# Altium project DAQ.PrjPcb
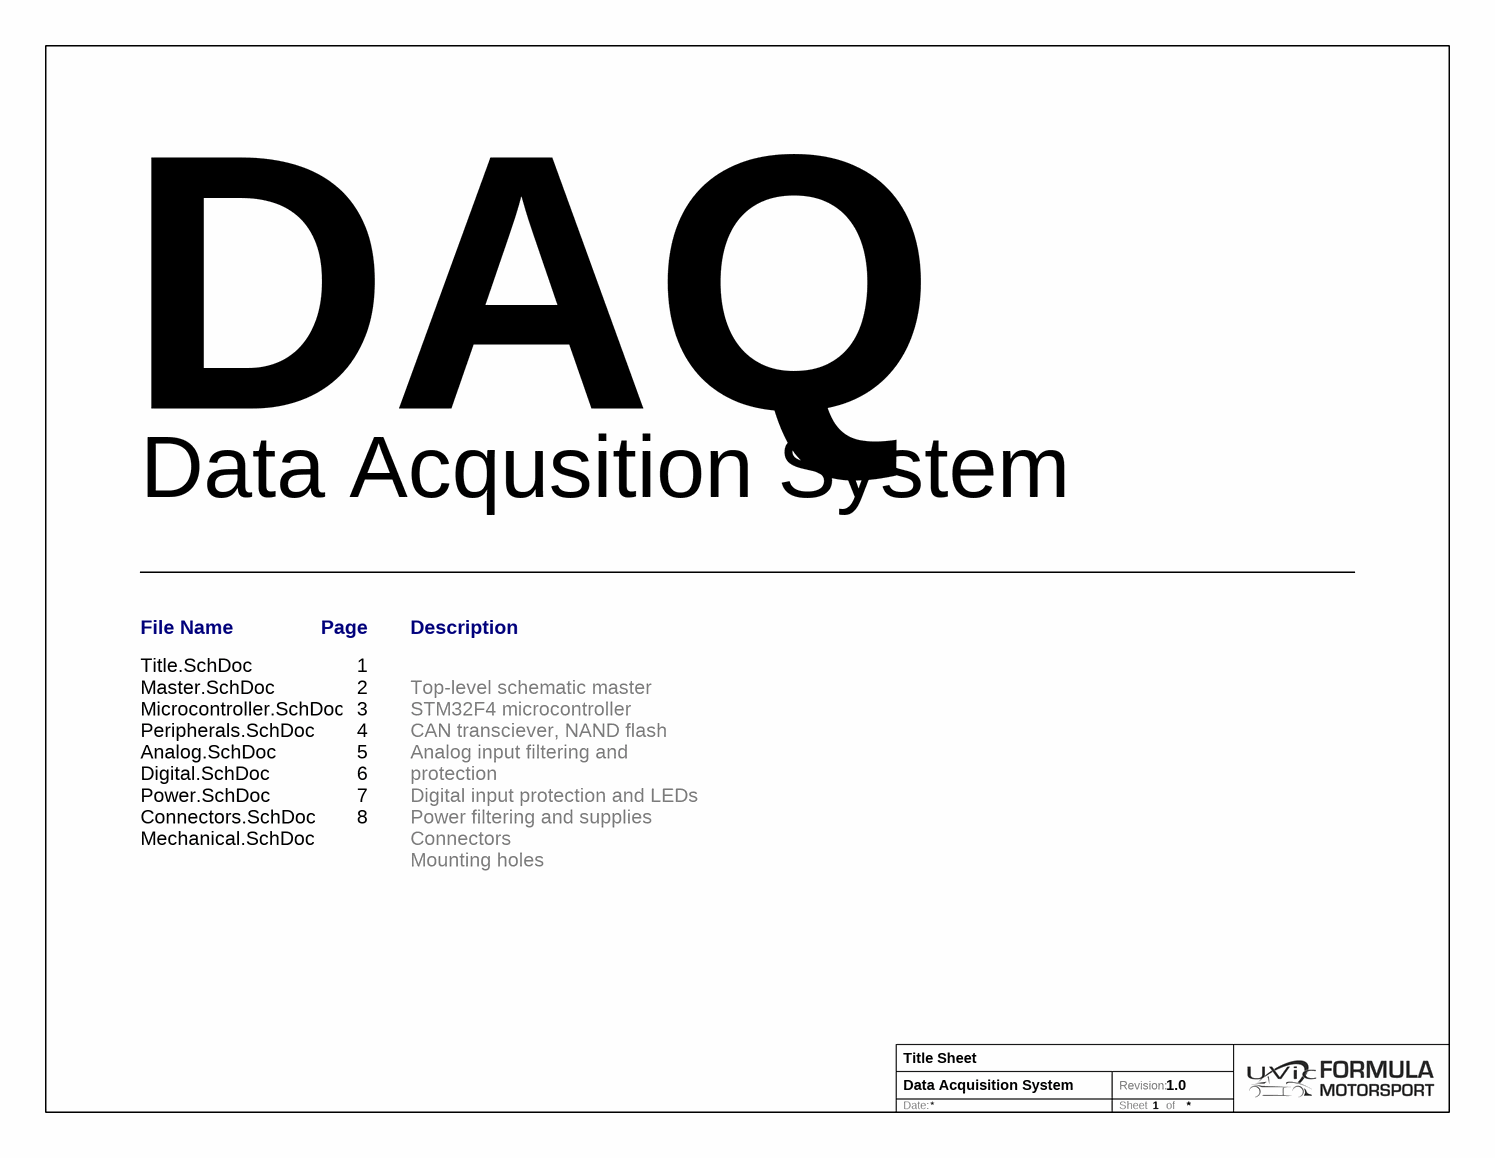
[diagram p0: Title.SchDoc]
9 sheets, 99 parts. Net scope: hierarchical (ports join the sheet entries above them; power ports are global).
Board file: DAQ.PcbDoc
Sheets:
  Title.SchDoc
  Master.SchDoc
    Microcontroller = Microcontroller.SchDoc
    Power = Power.SchDoc
    Peripherals = Peripherals.SchDoc
    Connectors = Connectors.SchDoc
    Analog = Analog.SchDoc
    Digital = Digital.SchDoc
    Mechanical = Mechanical.SchDoc

## Sheet Title.SchDoc: Title Sheet
size Letter; Revision: 1.0; SheetNumber: 1; PageSetup: Record=PageOptions|CenterHorizontal=True|CenterVertical=True|PrintScale=1.00|XCorrection=1.00|YCorrection=1.00|PrintKind=1|BorderSize=5000000|LeftOffset=0|BottomOffset=0|Orientation=2|PaperLength=1000|PaperWidth=1000|Scale=100|PaperSource=7|PrintQuality=-3|MediaType=1|DitherType=10|PrintScaleMode=1|PaperKind=Letter|PaperIndex=1; ProjectTitle: Data Acquisition System

### Notes on the sheet
- DAQ
- Data Acqusition System
- File Name
- Page
- Description
- 1
  2
  3
  4
  5
  6
  7
  8
  9
- Title.SchDoc
  Master.SchDoc
  Microcontroller.SchDoc
  Peripherals.SchDoc
  Analog.SchDoc
  Digital.SchDoc
  Power.SchDoc
  Connectors.SchDoc
  Mechanical.SchDoc
- Top-level schematic master
  STM32F4 microcontroller
  CAN transciever, NAND flash
  Analog input filtering and protection
  Digital input protection and LEDs
  Power filtering and supplies
  Connectors
  Mounting holes
- Date:
- Revision:
- Sheet
- of

## Sheet Master.SchDoc: Top-Level Sheet
size Letter; Revision: 1.0; SheetNumber: 2; PageSetup: Record=PageOptions|CenterHorizontal=True|CenterVertical=True|PrintScale=1.00|XCorrection=1.00|YCorrection=1.00|PrintKind=1|BorderSize=5000000|LeftOffset=0|BottomOffset=0|Orientation=2|PaperLength=1000|PaperWidth=1000|Scale=100|PaperSource=7|PrintQuality=-3|MediaType=1|DitherType=10|PrintScaleMode=1|PaperKind=Letter|PaperIndex=1; ProjectTitle: Data Acquisition System
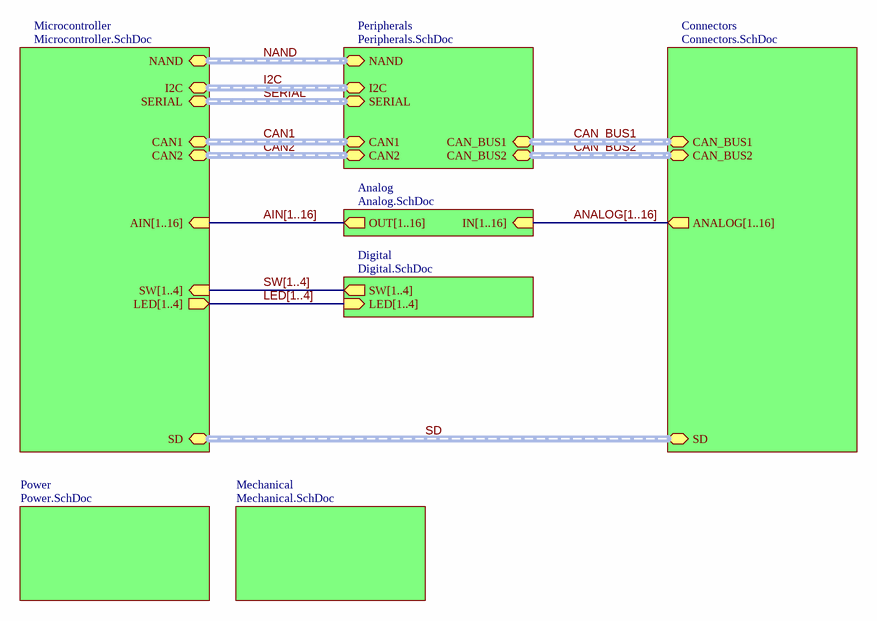
[diagram p1: Master.SchDoc]

### Sub-sheets
Analog = Analog.SchDoc: OUT[1..16] (out), IN[1..16] (in)
Connectors = Connectors.SchDoc: CAN_BUS1 (harness CAN_BUS1), CAN_BUS2 (harness CAN_BUS2), SD (harness SD), ANALOG[1..16] (out)
Digital = Digital.SchDoc: SW[1..4] (out), LED[1..4] (in)
Mechanical = Mechanical.SchDoc: no entries
Microcontroller = Microcontroller.SchDoc: AIN[1..16] (in), SW[1..4] (in), LED[1..4] (out), SD (harness SD), CAN1 (harness CAN1), CAN2 (harness CAN2), NAND (harness NAND), I2C (harness I2C), SERIAL (harness SERIAL)
Peripherals = Peripherals.SchDoc: CAN1 (harness CAN1), CAN2 (harness CAN2), NAND (harness NAND), CAN_BUS1 (harness CAN_BUS1), CAN_BUS2 (harness CAN_BUS2), I2C (harness I2C), SERIAL (harness SERIAL)
Power = Power.SchDoc: no entries

### Buses and harness runs
bus AIN[1..16] = sheet Analog/OUT[1..16] = sheet Microcontroller/AIN[1..16]
bus ANALOG[1..16] = sheet Analog/IN[1..16] = sheet Connectors/ANALOG[1..16]
bus LED[1..4] = sheet Digital/LED[1..4] = sheet Microcontroller/LED[1..4]
bus SW[1..4] = sheet Digital/SW[1..4] = sheet Microcontroller/SW[1..4]
harness CAN1 = sheet Microcontroller/CAN1 = sheet Peripherals/CAN1
harness CAN2 = sheet Microcontroller/CAN2 = sheet Peripherals/CAN2
harness CAN_BUS1 = sheet Connectors/CAN_BUS1 = sheet Peripherals/CAN_BUS1
harness CAN_BUS2 = sheet Connectors/CAN_BUS2 = sheet Peripherals/CAN_BUS2
harness I2C = sheet Microcontroller/I2C = sheet Peripherals/I2C
harness NAND = sheet Microcontroller/NAND = sheet Peripherals/NAND
harness SD = sheet Connectors/SD = sheet Microcontroller/SD
harness SERIAL = sheet Microcontroller/SERIAL = sheet Peripherals/SERIAL

### Notes on the sheet
- Date:
- Revision:
- Sheet
- of

## Sheet Microcontroller.SchDoc: Microcontroller
size Letter; Revision: 1.0; SheetNumber: 3; PageSetup: Record=PageOptions|CenterHorizontal=True|CenterVertical=True|PrintScale=1.00|XCorrection=1.00|YCorrection=1.00|PrintKind=1|BorderSize=5000000|LeftOffset=0|BottomOffset=0|Orientation=2|PaperLength=1000|PaperWidth=1000|Scale=100|PaperSource=7|PrintQuality=-3|MediaType=1|DitherType=10|PrintScaleMode=1|PaperKind=Letter|PaperIndex=1; ProjectTitle: Data Acquisition System
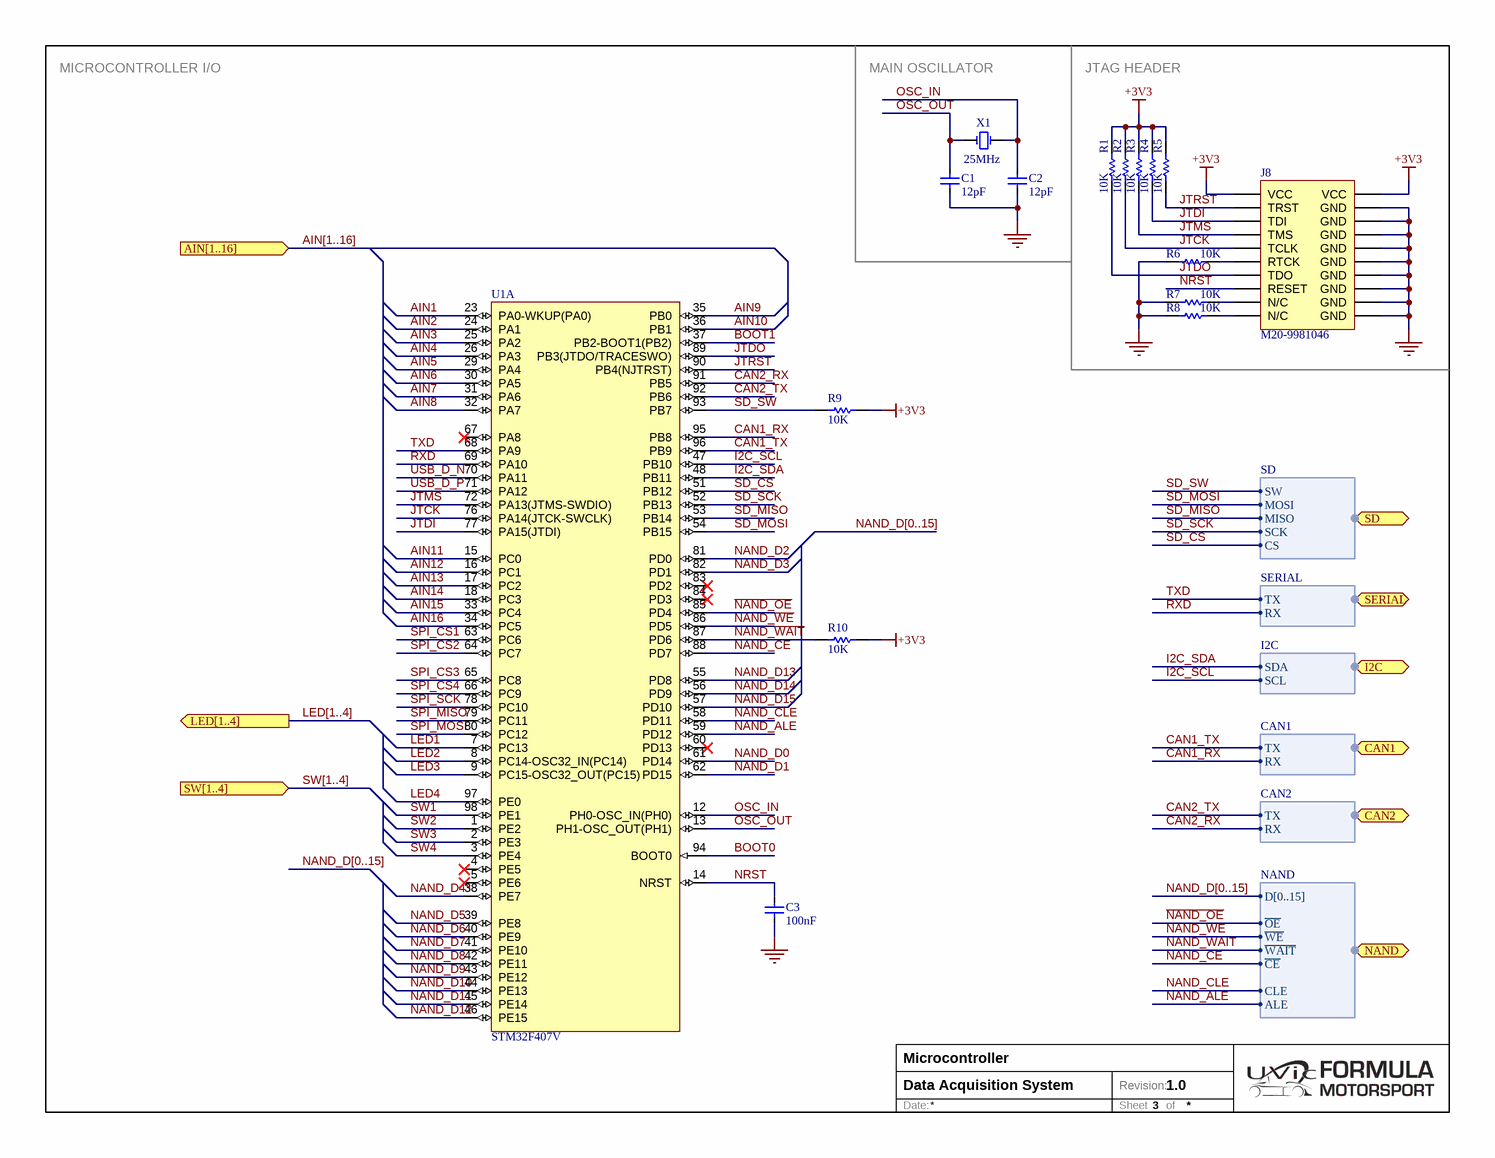
[diagram p2: Microcontroller.SchDoc]

### Parts
(Parts that share a designator on the sheet are numbered #1, #2 ... from top to bottom, then left to right.)
C1  value 12pF  [CAP-0603-M]  (hidden comment: Capacitor 12pF 50V 0603)
C2  value 12pF  [CAP-0603-M]  (hidden comment: Capacitor 12pF 50V 0603)
C3  value 100nF  [CAP-0603-M]  (hidden comment: Capacitor 100nF 25V 0603)
J8#1  M20-9981046  [M20-9981046]
R1  value 10K  [RES-0603-M]  (hidden comment: Resistor 10K 1/10 W 0603)
R2  value 10K  [RES-0603-M]  (hidden comment: Resistor 10K 1/10 W 0603)
R3  value 10K  [RES-0603-M]  (hidden comment: Resistor 10K 1/10 W 0603)
R4  value 10K  [RES-0603-M]  (hidden comment: Resistor 10K 1/10 W 0603)
R5  value 10K  [RES-0603-M]  (hidden comment: Resistor 10K 1/10 W 0603)
R6  value 10K  [RES-0603-M]  (hidden comment: Resistor 10K 1/10 W 0603)
R7  value 10K  [RES-0603-M]  (hidden comment: Resistor 10K 1/10 W 0603)
R8  value 10K  [RES-0603-M]  (hidden comment: Resistor 10K 1/10 W 0603)
R9  value 10K  [RES-0603-M]  (hidden comment: Resistor 10K 1/10 W 0603)
R10  value 10K  [RES-0603-M]  (hidden comment: Resistor 10K 1/10 W 0603)
U1  STM32F407V  [100-LQFP-14x14-0.5]  (part A of 2)
X1  value 25MHz  [TXC-AA]  (hidden comment: AA-25.000M)

### Ports
AIN[1..16] (in), CAN1 (harness CAN1), CAN2 (harness CAN2), I2C (harness I2C), LED[1..4] (out), NAND (harness NAND), SD (harness SD), SERIAL (harness SERIAL), SW[1..4] (in)

### Harnesses
SD: MOSI, MISO, SCK, CS, SW
CAN1: TX, RX
CAN2: TX, RX
NAND: D[0..15], ~{OE}, ~{WE}, ~{WAIT}, ~{CE}, CLE, ALE
I2C: SDA, SCL
SERIAL: TX, RX

### Nets
+3V3: J8#1.1(VCC) J8#1.2(VCC) R1.1 R2.1 R3.1 R4.1 R5.1 R9.1 R10.1
GND: C1.1 C2.1 C3.2 J8#1.4(GND) J8#1.6(GND) J8#1.8(GND) J8#1.10(GND) J8#1.12(GND) J8#1.14(GND) J8#1.16(GND) J8#1.18(GND) J8#1.20(GND) R6.2 R7.2 R8.2
AIN1: U1.23(PA0-WKUP(PA0))
AIN2: U1.24(PA1)
AIN3: U1.25(PA2)
AIN4: U1.26(PA3)
AIN5: U1.29(PA4)
AIN6: U1.30(PA5)
AIN7: U1.31(PA6)
AIN8: U1.32(PA7)
AIN9: U1.35(PB0)
AIN10: U1.36(PB1)
AIN11: U1.15(PC0)
AIN12: U1.16(PC1)
AIN13: U1.17(PC2)
AIN14: U1.18(PC3)
AIN15: U1.33(PC4)
AIN16: U1.34(PC5)
BOOT0: U1.94(BOOT0)
BOOT1: U1.37(PB2-BOOT1(PB2))
CAN1_RX: U1.95(PB8) ; port CAN1.RX  [project net CAN1.RX]
CAN1_TX: U1.96(PB9) ; port CAN1.TX  [project net CAN1.TX]
CAN2_RX: U1.91(PB5) ; port CAN2.RX  [project net CAN2.RX]
CAN2_TX: U1.92(PB6) ; port CAN2.TX  [project net CAN2.TX]
I2C_SCL: U1.47(PB10) ; port I2C.SCL  [project net I2C.SCL]
I2C_SDA: U1.48(PB11) ; port I2C.SDA  [project net I2C.SDA]
JTCK: J8#1.9(TCLK) R2.2 U1.76(PA14(JTCK-SWCLK))
JTDI: J8#1.5(TDI) R4.2 U1.77(PA15(JTDI))
JTDO: J8#1.13(TDO) R1.2 U1.89(PB3(JTDO/TRACESWO))
JTMS: J8#1.7(TMS) R3.2 U1.72(PA13(JTMS-SWDIO))
JTRST: J8#1.3(TRST) R5.2 U1.90(PB4(NJTRST))
LED1: U1.7(PC13)
LED2: U1.8(PC14-OSC32_IN(PC14))
LED3: U1.9(PC15-OSC32_OUT(PC15))
LED4: U1.97(PE0)
~{NAND_CE}: U1.88(PD7) ; port NAND.~{CE}
~{NAND_OE}: U1.85(PD4) ; port NAND.~{OE}
~{NAND_WAIT}: R10.2 U1.87(PD6) ; port NAND.~{WAIT}
~{NAND_WE}: U1.86(PD5) ; port NAND.~{WE}
NAND_ALE: U1.59(PD12) ; port NAND.ALE  [project net NAND.ALE]
NAND_CLE: U1.58(PD11) ; port NAND.CLE  [project net NAND.CLE]
NAND_D0: U1.61(PD14)
NAND_D1: U1.62(PD15)
NAND_D2: U1.81(PD0)
NAND_D3: U1.82(PD1)
NAND_D4: U1.38(PE7)
NAND_D5: U1.39(PE8)
NAND_D6: U1.40(PE9)
NAND_D7: U1.41(PE10)
NAND_D8: U1.42(PE11)
NAND_D9: U1.43(PE12)
NAND_D10: U1.44(PE13)
NAND_D11: U1.45(PE14)
NAND_D12: U1.46(PE15)
NAND_D13: U1.55(PD8)
NAND_D14: U1.56(PD9)
NAND_D15: U1.57(PD10)
NRST: C3.1 J8#1.15(RESET) U1.14(NRST)
OSC_IN: C2.2 U1.12(PH0-OSC_IN(PH0)) X1.2
OSC_OUT: C1.2 U1.13(PH1-OSC_OUT(PH1)) X1.1
RXD: U1.69(PA10) ; port SERIAL.RX
SD_CS: U1.51(PB12) ; port SD.CS  [project net SD.CS]
SD_MISO: U1.53(PB14) ; port SD.MISO  [project net SD.MISO]
SD_MOSI: U1.54(PB15) ; port SD.MOSI  [project net SD.MOSI]
SD_SCK: U1.52(PB13) ; port SD.SCK  [project net SD.SCK]
SD_SW: R9.2 U1.93(PB7) ; port SD.SW  [project net SD.SW]
SPI_CS1: U1.63(PC6)
SPI_CS2: U1.64(PC7)
SPI_CS3: U1.65(PC8)
SPI_CS4: U1.66(PC9)
SPI_MISO: U1.79(PC11)
SPI_MOSI: U1.80(PC12)
SPI_SCK: U1.78(PC10)
SW1: U1.98(PE1)
SW2: U1.1(PE2)
SW3: U1.2(PE3)
SW4: U1.3(PE4)
TXD: U1.68(PA9) ; port SERIAL.TX  [project net SERIAL.TX]
USB_D_N: U1.70(PA11)
USB_D_P: U1.71(PA12)
NetJ8#1_11: J8#1.11(RTCK) R6.1
NetJ8#1_17: J8#1.17(N/C) R7.1
NetJ8#1_19: J8#1.19(N/C) R8.1

Not connected (* = marked no-connect by the designer): U1 4(PE5)* 5(PE6)* 60(PD13)* 67(PA8)* 83(PD2)* 84(PD3)*

### Buses and harness runs
bus AIN[1..16] = port AIN[1..16]
bus LED[1..4] = port LED[1..4]
bus NAND_D[0..15]
bus SW[1..4] = port SW[1..4]

### Notes on the sheet
- MICROCONTROLLER I/O
- MAIN OSCILLATOR
- JTAG HEADER
- Date:
- Revision:
- Sheet
- of

### Library data of the parts
C1 C2 = CC0603JRNPO9BN120: Manufacturer: Yageo; Manufacturer Series: CC; Tolerance: ±5%; Temperature Coefficient: C0G, NP0; Part Number: CC0603JRNPO9BN120; Component Type: Standard; Voltage: 50V; Package: 0603; Temperature Range: -55°C ~ 125°C; Supplier 1: Digi-Key; Supplier Part Number 1: 311-1059-1-ND
C3 = CC0603KRX7R8BB104: Manufacturer: Yageo; Manufacturer Series: CC; Tolerance: ±10%; Temperature Coefficient: X7R; Part Number: CC0603KRX7R8BB104; Component Type: Standard; Voltage: 25V; Package: 0603; Temperature Range: -55°C ~ 125°C; Supplier 1: Digi-Key; Supplier Part Number 1: 311-1341-1-ND
J8#1 = M20-9981046: 2.54mm Header 2x10-Pin; Supplier 1: Digi-Key; Supplier Part Number 1: 952-2130-ND
R1-R10 = RC0603FR-0710KL: Manufacturer: Yageo; Manufacturer Series: RC; Tolerance: 1%; Power: 1/10 W; Temperature Coefficient: ±100ppm/°C; Part Number: RC0603FR-0710KL; Component Type: Standard; Package: 0603; Temperature Range: -55°C ~ 155°C; Supplier 1: Digi-Key; Supplier Part Number 1: 311-10.0KHRCT-ND
U1 = STM32F407V: STM32F407 100-LQFP; Supplier 1: Digi-Key; Supplier Part Number 1: 497-11605-ND
X1 = AA-25.000M: TXC AA SMD Automotive Crystal; Supplier 1: Digi-Key; Supplier Part Number 1: 887-1662-1-ND

## Sheet Power.SchDoc: Power
size Letter; Revision: 1.0; SheetNumber: 7; PageSetup: Record=PageOptions|CenterHorizontal=True|CenterVertical=True|PrintScale=1.00|XCorrection=1.00|YCorrection=1.00|PrintKind=1|BorderSize=5000000|LeftOffset=0|BottomOffset=0|Orientation=2|PaperLength=1000|PaperWidth=1000|Scale=100|PaperSource=7|PrintQuality=-3|MediaType=1|DitherType=10|PrintScaleMode=1|PaperKind=Letter|PaperIndex=1; ProjectTitle: Data Acquisition System
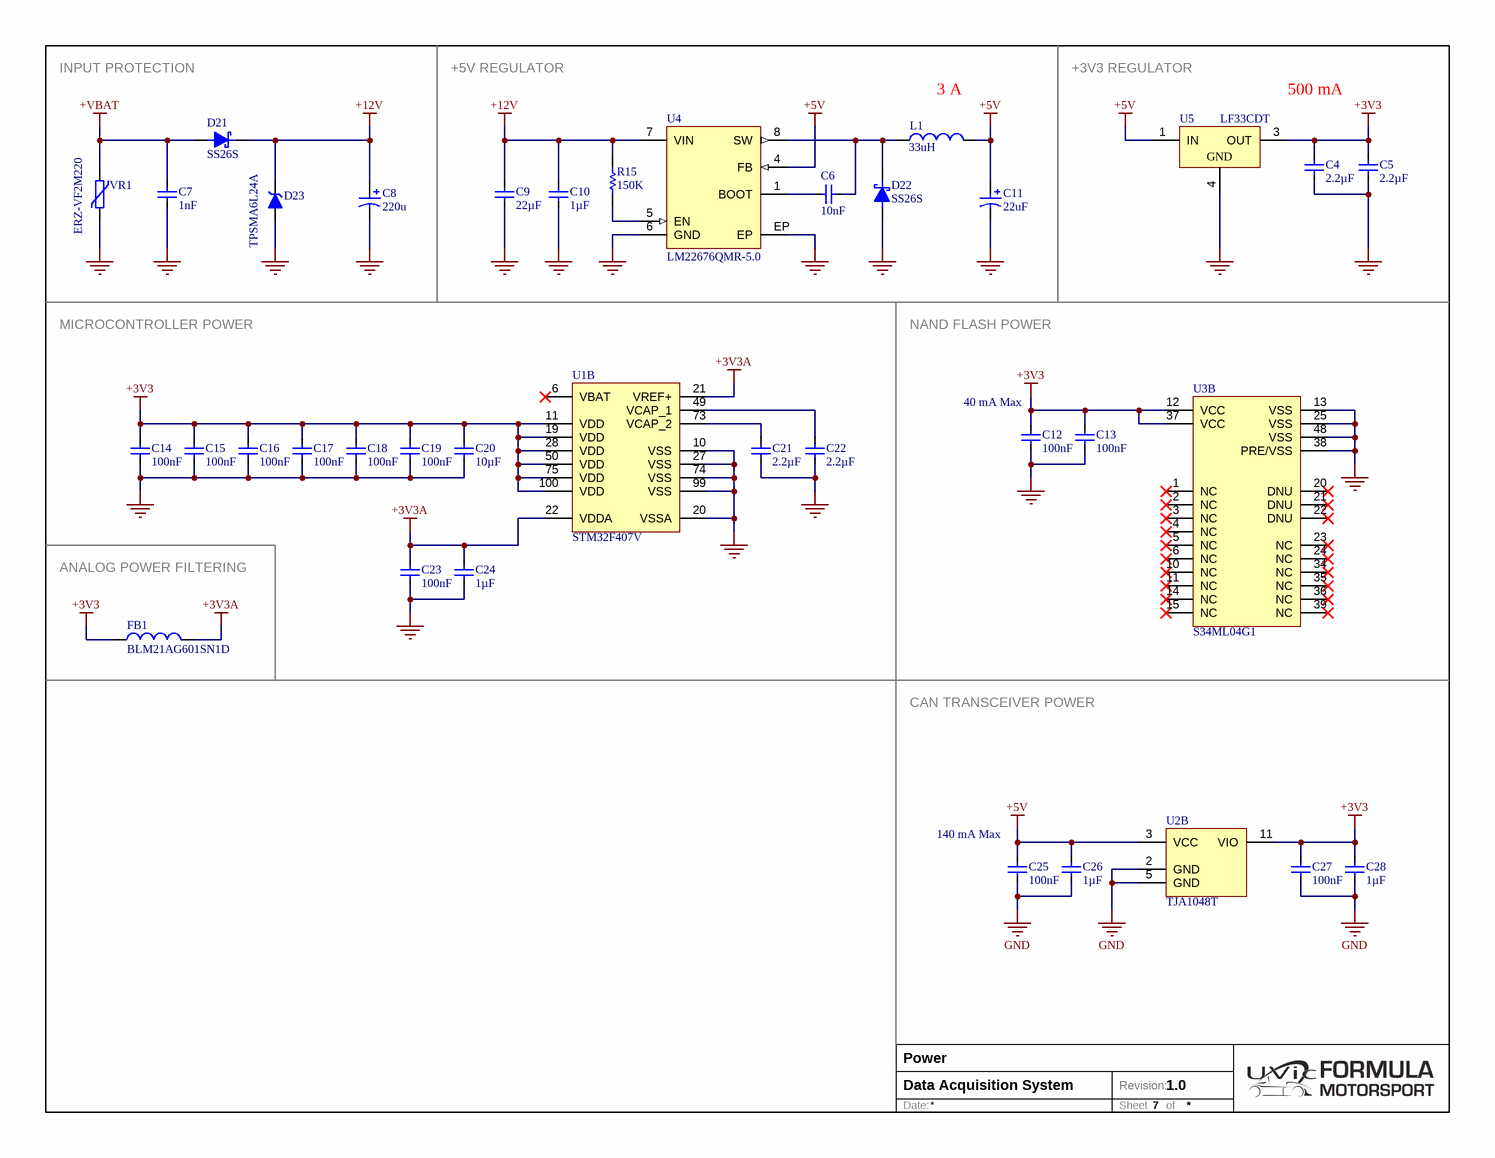
[diagram p3: Power.SchDoc]

### Parts
C4  value 2.2µF  [CAP-0805-M]  (hidden comment: Capacitor 2.2µF 10V 0805)
C5  value 2.2µF  [CAP-0805-M]  (hidden comment: Capacitor 2.2µF 10V 0805)
C6  value 10nF  [CAP-0603-M]  (hidden comment: Capacitor 10nF 50V 0603)
C7  value 1nF  [CAP-0805-M]  (hidden comment: Capacitor 1nF 50V 0805)
C8  value 220u  [CAPAE9083X70M]  (hidden comment: PCR1E221MCL1GS)
C9  value 22µF  [CAP-1210-M]  (hidden comment: Capacitor 22µF 25V 1210)
C10  value 1µF  [CAP-0805-M]  (hidden comment: Capacitor 1µF 16V 0805)
C11  value 22uF  [CAP-B1]  (hidden comment: 8TPC22M)
C12  value 100nF  [CAP-0603-M]  (hidden comment: Capacitor 100nF 25V 0603)
C13  value 100nF  [CAP-0603-M]  (hidden comment: Capacitor 100nF 25V 0603)
C14  value 100nF  [CAP-0603-M]  (hidden comment: Capacitor 100nF 25V 0603)
C15  value 100nF  [CAP-0603-M]  (hidden comment: Capacitor 100nF 25V 0603)
C16  value 100nF  [CAP-0603-M]  (hidden comment: Capacitor 100nF 25V 0603)
C17  value 100nF  [CAP-0603-M]  (hidden comment: Capacitor 100nF 25V 0603)
C18  value 100nF  [CAP-0603-M]  (hidden comment: Capacitor 100nF 25V 0603)
C19  value 100nF  [CAP-0603-M]  (hidden comment: Capacitor 100nF 25V 0603)
C20  value 10µF  [CAP-0805-M]  (hidden comment: Capacitor 10µF 10V 0805)
C21  value 2.2µF  [CAP-0805-M]  (hidden comment: Capacitor 2.2µF 10V 0805)
C22  value 2.2µF  [CAP-0805-M]  (hidden comment: Capacitor 2.2µF 10V 0805)
C23  value 100nF  [CAP-0603-M]  (hidden comment: Capacitor 100nF 25V 0603)
C24  value 1µF  [CAP-0805-M]  (hidden comment: Capacitor 1µF 16V 0805)
C25  value 100nF  [CAP-0603-M]  (hidden comment: Capacitor 100nF 25V 0603)
C26  value 1µF  [CAP-0805-M]  (hidden comment: Capacitor 1µF 16V 0805)
C27  value 100nF  [CAP-0603-M]  (hidden comment: Capacitor 100nF 25V 0603)
C28  value 1µF  [CAP-0805-M]  (hidden comment: Capacitor 1µF 16V 0805)
D21  SS26S  [DO-214AC (SMA)]
D22  SS26S  [DO-214AC (SMA)]
D23  TPSMA6L24A  [SODFL520X110-2N]
FB1  BLM21AG601SN1D  [MURA-BLM21A]
L1  value 33uH  [INDP125125X65N]  (hidden comment: SRR1260A-330M)
R15  value 150K  [RES-0603-M]  (hidden comment: Resistor 150K 1/10 W 0603)
U1  STM32F407V  [100-LQFP-14x14-0.5]  (part B of 2)
U2  TJA1048T  [SOP127P600X175-14N]  (part B of 2)
U3  S34ML04G1  [48-TSOP]  (part B of 2)
U4  LM22676QMR-5.0  [8-SOIC-EP-4.9x3.9mm]
U5  LF33CDT  [TO-252_M]
VR1  ERZ-VF2M220  [ERZ-VF]

### Nets
+3V3: C4.2 C5.2 C12.1 C13.1 C14.1 C15.1 C16.1 C17.1 C18.1 C19.1 C20.1 C27.1 C28.2 FB1.1 U1.11(VDD) U1.19(VDD) U1.28(VDD) U1.50(VDD) U1.75(VDD) U1.100(VDD) U2.11(VIO) U3.12(VCC) U3.37(VCC) U5.3(OUT)
+3V3A: C23.1 C24.2 FB1.2 U1.21(VREF+) U1.22(VDDA)
+5V: C11.1 C25.1 C26.2 L1.2 U2.3(VCC) U4.4(FB) U5.1(IN)
+12V: C8.1 C9.2 C10.2 D21.1(K) D23.1(A) R15.2 U4.7(VIN)
+VBAT: C7.2 D21.2(A) VR1.2
GND: C4.1 C5.1 C7.1 C8.2 C9.1 C10.1 C11.2 C12.2 C13.2 C14.2 C15.2 C16.2 C17.2 C18.2 C19.2 C20.2 C21.1 C22.1 C23.2 C24.1 C25.2 C26.1 C27.2 C28.1 D22.2(A) D23.2(C) U1.10(VSS) U1.20(VSSA) U1.27(VSS) U1.74(VSS) U1.99(VSS) U2.2(GND) U2.5(GND) U3.13(VSS) U3.25(VSS) U3.38(PRE/VSS) U3.48(VSS) U4.6(GND) U4.EP U5.4(GND) VR1.1
NetC6_1: C6.1 U4.1(BOOT)
NetC6_2: C6.2 D22.1(K) L1.1 U4.8(SW)
NetC21_2: C21.2 U1.73(VCAP_2)
NetC22_2: C22.2 U1.49(VCAP_1)
NetR15_1: R15.1 U4.5(EN)

Not connected (* = marked no-connect by the designer): U1 6(VBAT)*; U3 1(NC)* 2(NC)* 3(NC)* 4(NC)* 5(NC)* 6(NC)* 10(NC)* 11(NC)* 14(NC)* 15(NC)* 20(DNU)* 21(DNU)* 22(DNU)* 23(NC)* 24(NC)* 34(NC)* 35(NC)* 36(NC)* 39(NC)*; U4 2(NC) 3(NC)

### Notes on the sheet
- INPUT PROTECTION
- +5V REGULATOR
- (near L1) 3 A
- +3V3 REGULATOR
- 500 mA
- MICROCONTROLLER POWER
- NAND FLASH POWER
- (near C12) 40 mA Max
- ANALOG POWER FILTERING
- CAN TRANSCEIVER POWER
- (near C25) 140 mA Max
- Date:
- Revision:
- Sheet
- of

### Library data of the parts
C4 C5 C21 C22 = CC0805KKX7R6BB225: Manufacturer: Yageo; Manufacturer Series: CC; Tolerance: ±10%; Temperature Coefficient: X7R; Part Number: CC0805KKX7R6BB225; Component Type: Standard; Voltage: 10V; Package: 0805; Temperature Range: -55°C ~ 125°C; Supplier 1: Digi-Key; Supplier Part Number 1: 311-1368-1-ND
C6 = CC0603KRX7R9BB103: Manufacturer: Yageo; Manufacturer Series: CC; Tolerance: ±10%; Temperature Coefficient: X7R; Part Number: CC0603KRX7R9BB103; Component Type: Standard; Voltage: 50V; Package: 0603; Temperature Range: -55°C ~ 125°C; Supplier 1: Digi-Key; Supplier Part Number 1: 311-1085-1-ND
C7 = CC0805KRX7R9BB102: Manufacturer: Yageo; Manufacturer Series: CC; Tolerance: ±10%; Temperature Coefficient: X7R; Part Number: CC0805KRX7R9BB102; Component Type: Standard; Voltage: 50V; Package: 0805; Temperature Range: -55°C ~ 125°C; Supplier 1: Digi-Key; Supplier Part Number 1: 311-1127-1-ND
C8 = PCR1E221MCL1GS: SMD Polymer Electrolytic Capacitor; Supplier 1: Digi-Key; Supplier Part Number 1: 493-13752-1-ND
C9 = CC1210KKX7R8BB226: Manufacturer: Yageo; Manufacturer Series: CC; Tolerance: ±10%; Temperature Coefficient: X7R; Part Number: CC1210KKX7R8BB226; Component Type: Standard; Voltage: 25V; Package: 1210; Temperature Range: -55°C ~ 125°C; Supplier 1: Digi-Key; Supplier Part Number 1: 311-2032-1-ND
C10 C24 C26 C28 = CC0805KKX7R7BB105: Manufacturer: Yageo; Manufacturer Series: CC; Tolerance: ±10%; Temperature Coefficient: X7R; Part Number: CC0805KKX7R7BB105; Component Type: Standard; Voltage: 16V; Package: 0805; Temperature Range: -55°C ~ 125°C; Supplier 1: Digi-Key; Supplier Part Number 1: 311-1365-1-ND
C11 = 8TPC22M: CAP TANT 22UF 8V 20% B1; Supplier 1: Digi-Key; Supplier Part Number 1: P16219CT-ND
C12-C19 C23 C25 C27 = CC0603KRX7R8BB104: as C3 on sheet Microcontroller; Part Number: CC0603KRX7R8BB104; Component Type: Standard; Voltage: 25V; Package: 0603; Temperature Range: -55°C ~ 125°C; Supplier 1: Digi-Key; Supplier Part Number 1: 311-1341-1-ND
C20 = CC0805KKX5R6BB106: Manufacturer: Yageo; Manufacturer Series: CC; Tolerance: ±10%; Temperature Coefficient: X5R; Part Number: CC0805KKX5R6BB106; Component Type: Standard; Voltage: 10V; Package: 0805; Temperature Range: -55°C ~ 85°C; Supplier 1: Digi-Key; Supplier Part Number 1: 311-1460-1-ND
D21 D22 = SS26S: SMD Schottky Diode; Supplier 1: Digi-Key; Supplier Part Number 1: 475-1278-1-ND
D23 = TPSMA6L24A: SMD TVS Diode; Supplier 1: Digi-Key; Supplier Part Number 1: F6148CT-ND
FB1 = BLM21AG601SN1D: Chip Ferrite Bead (0805) 600R at 100MHz; Supplier 1: Digi-Key; Supplier Part Number 1: 490-1040-1-ND
L1 = SRR1260A-330M: SRR1260 Shield SMD Power Inductor; Supplier 1: Digi-Key; Supplier Part Number 1: SRR1260A-330MCT-ND
R15 = RC0603FR-07150KL: Manufacturer: Yageo; Manufacturer Series: RC; Tolerance: 1%; Power: 1/10 W; Temperature Coefficient: ±100ppm/°C; Part Number: RC0603FR-07150KL; Component Type: Standard; Package: 0603; Temperature Range: -55°C ~ 155°C; Supplier 1: Digi-Key; Supplier Part Number 1: 311-150KHRCT-ND
U1 = STM32F407V: STM32F407 100-LQFP; Supplier 1: Digi-Key; Supplier Part Number 1: 497-11605-ND
U2 = TJA1048T: Dual CAN transceiver; Supplier 1: Digi-Key; Supplier Part Number 1: 568-8681-1-ND
U5 = LF33CDT: LDO Fixed 3.3 Automotive; Supplier 1: Digi-Key; Supplier Part Number 1: 497-1532-1-ND
VR1 = ERZ-VF2M220: SMD Varistor 22V; Supplier 1: Digi-Key; Supplier Part Number 1: P7345CT-ND
U4 = LM22676QMR-5.0: Supplier 1: Digi-Key; Supplier Part Number 1: LM22676QMR-5.0/NOPB-ND

## Sheet Peripherals.SchDoc: Peripherals
size Letter; Revision: 1.0; SheetNumber: 4; PageSetup: Record=PageOptions|CenterHorizontal=True|CenterVertical=True|PrintScale=1.00|XCorrection=1.00|YCorrection=1.00|PrintKind=1|BorderSize=5000000|LeftOffset=0|BottomOffset=0|Orientation=2|PaperLength=1000|PaperWidth=1000|Scale=100|PaperSource=7|PrintQuality=-3|MediaType=1|DitherType=10|PrintScaleMode=1|PaperKind=Letter|PaperIndex=1; ProjectTitle: Data Acquisition System
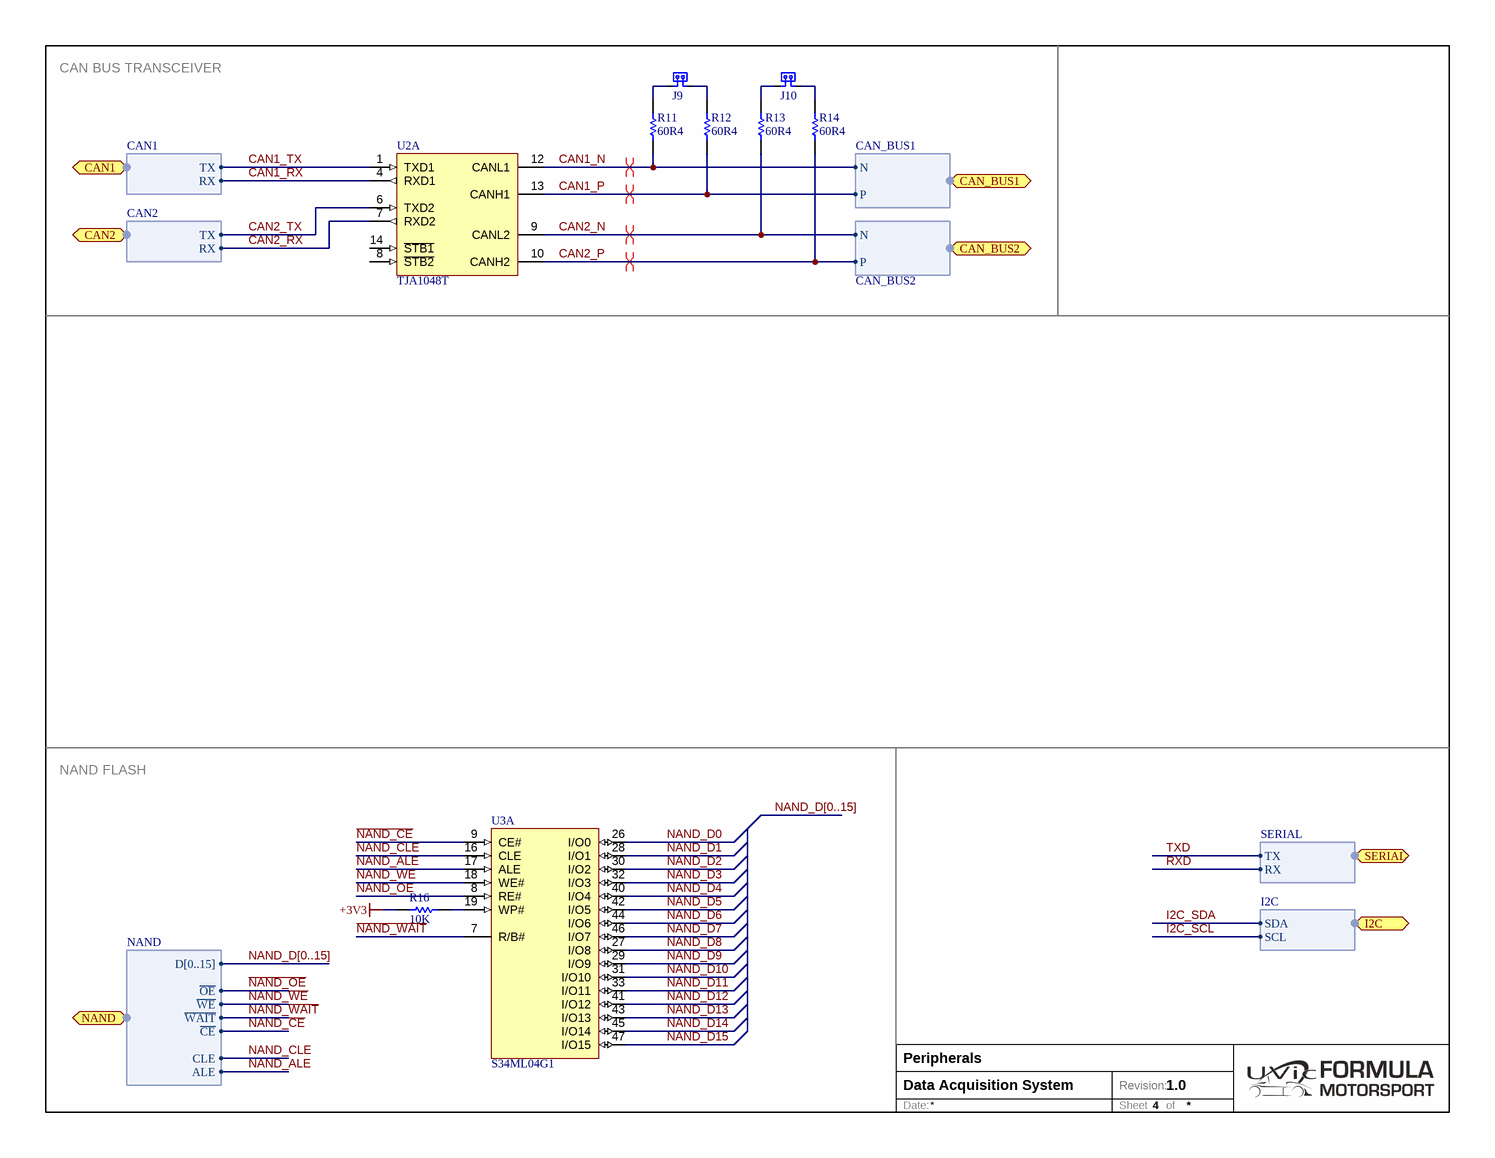
[diagram p4: Peripherals.SchDoc]

### Parts
J9  M20-9990246  [M20-9990246]  (value not drawn)
J10  M20-9990246  [M20-9990246]  (value not drawn)
R11  value 60R4  [RES-1206-M]  (hidden comment: Resistor 60R4 1/4 W 1206)
R12  value 60R4  [RES-1206-M]  (hidden comment: Resistor 60R4 1/4 W 1206)
R13  value 60R4  [RES-1206-M]  (hidden comment: Resistor 60R4 1/4 W 1206)
R14  value 60R4  [RES-1206-M]  (hidden comment: Resistor 60R4 1/4 W 1206)
R16  value 10K  [RES-0603-M]  (hidden comment: Resistor 10K 1/10 W 0603)
U2  TJA1048T  [SOP127P600X175-14N]  (part A of 2)
U3  S34ML04G1  [48-TSOP]  (part A of 2)

### Ports
CAN1 (harness CAN1), CAN2 (harness CAN2), CAN_BUS1 (harness CAN_BUS1), CAN_BUS2 (harness CAN_BUS2), I2C (harness I2C), NAND (harness NAND), SERIAL (harness SERIAL)

### Harnesses
CAN1: TX, RX
CAN2: TX, RX
NAND: D[0..15], ~{OE}, ~{WE}, ~{WAIT}, ~{CE}, CLE, ALE
CAN_BUS1: N, P
CAN_BUS2: N, P
I2C: SDA, SCL
SERIAL: TX, RX

### Nets
+3V3: R16.2
CAN1_N: R11.2 U2.12(CANL1) ; port CAN_BUS1.N
CAN1_P: R12.2 U2.13(CANH1) ; port CAN_BUS1.P
CAN1_RX: U2.4(RXD1) ; port CAN1.RX  [project net CAN1.RX]
CAN1_TX: U2.1(TXD1) ; port CAN1.TX  [project net CAN1.TX]
CAN2_N: R13.2 U2.9(CANL2) ; port CAN_BUS2.N
CAN2_P: R14.2 U2.10(CANH2) ; port CAN_BUS2.P
CAN2_RX: U2.7(RXD2) ; port CAN2.RX  [project net CAN2.RX]
CAN2_TX: U2.6(TXD2) ; port CAN2.TX  [project net CAN2.TX]
~{NAND_CE}: U3.9(CE#) ; port NAND.~{CE}
~{NAND_OE}: U3.8(RE#) ; port NAND.~{OE}
~{NAND_WAIT}: U3.7(R/B#) ; port NAND.~{WAIT}
~{NAND_WE}: U3.18(WE#) ; port NAND.~{WE}
NAND_ALE: U3.17(ALE) ; port NAND.ALE  [project net NAND.ALE]
NAND_CLE: U3.16(CLE) ; port NAND.CLE  [project net NAND.CLE]
NAND_D0: U3.26(I/O0)
NAND_D1: U3.28(I/O1)
NAND_D2: U3.30(I/O2)
NAND_D3: U3.32(I/O3)
NAND_D4: U3.40(I/O4)
NAND_D5: U3.42(I/O5)
NAND_D6: U3.44(I/O6)
NAND_D7: U3.46(I/O7)
NAND_D8: U3.27(I/O8)
NAND_D9: U3.29(I/O9)
NAND_D10: U3.31(I/O10)
NAND_D11: U3.33(I/O11)
NAND_D12: U3.41(I/O12)
NAND_D13: U3.43(I/O13)
NAND_D14: U3.45(I/O14)
NAND_D15: U3.47(I/O15)
NetJ9_1: J9.1 R11.1
NetJ9_2: J9.2 R12.1
NetJ10_1: J10.1 R13.1
NetJ10_2: J10.2 R14.1
NetR16_1: R16.1 U3.19(WP#)

Not connected (* = marked no-connect by the designer): U2 8(~{STB2}) 14(~{STB1})

### Buses and harness runs
bus NAND_D[0..15]

### Layout directives
differential pair: CAN1_N, CAN1_P, CAN2_N, CAN2_P

### Notes on the sheet
- CAN BUS TRANSCEIVER
- NAND FLASH
- Date:
- Revision:
- Sheet
- of

### Library data of the parts
J9 J10 = JUMPER-1: 2.54mm Header Jumper; Supplier 1: Digi-Key; Supplier Part Number 1: 952-2262-ND
R11-R14 = RC1206FR-0760R4L: Manufacturer: Yageo; Manufacturer Series: RC; Tolerance: ±1%; Power: 1/4 W; Temperature Coefficient: ±100ppm/°C; Part Number: RC1206FR-0760R4L; Component Type: Standard; Package: 1206; Temperature Range: -55°C ~ 155°C; Supplier 1: Digi-Key; Supplier Part Number 1: 311-60.4FRCT-ND
R16 = RC0603FR-0710KL: as R1 on sheet Microcontroller; Part Number: RC0603FR-0710KL; Component Type: Standard; Package: 0603; Temperature Range: -55°C ~ 155°C; Supplier 1: Digi-Key; Supplier Part Number 1: 311-10.0KHRCT-ND
U2 = TJA1048T: Dual CAN transceiver; Supplier 1: Digi-Key; Supplier Part Number 1: 568-8681-1-ND

## Sheet Connectors.SchDoc: Connectors
size Letter; Revision: 1.0; SheetNumber: 8; PageSetup: Record=PageOptions|CenterHorizontal=True|CenterVertical=True|PrintScale=1.00|XCorrection=1.00|YCorrection=1.00|PrintKind=1|BorderSize=5000000|LeftOffset=0|BottomOffset=0|Orientation=2|PaperLength=1000|PaperWidth=1000|Scale=100|PaperSource=7|PrintQuality=-3|MediaType=1|DitherType=10|PrintScaleMode=1|PaperKind=Letter|PaperIndex=1; ProjectTitle: Data Acquisition System
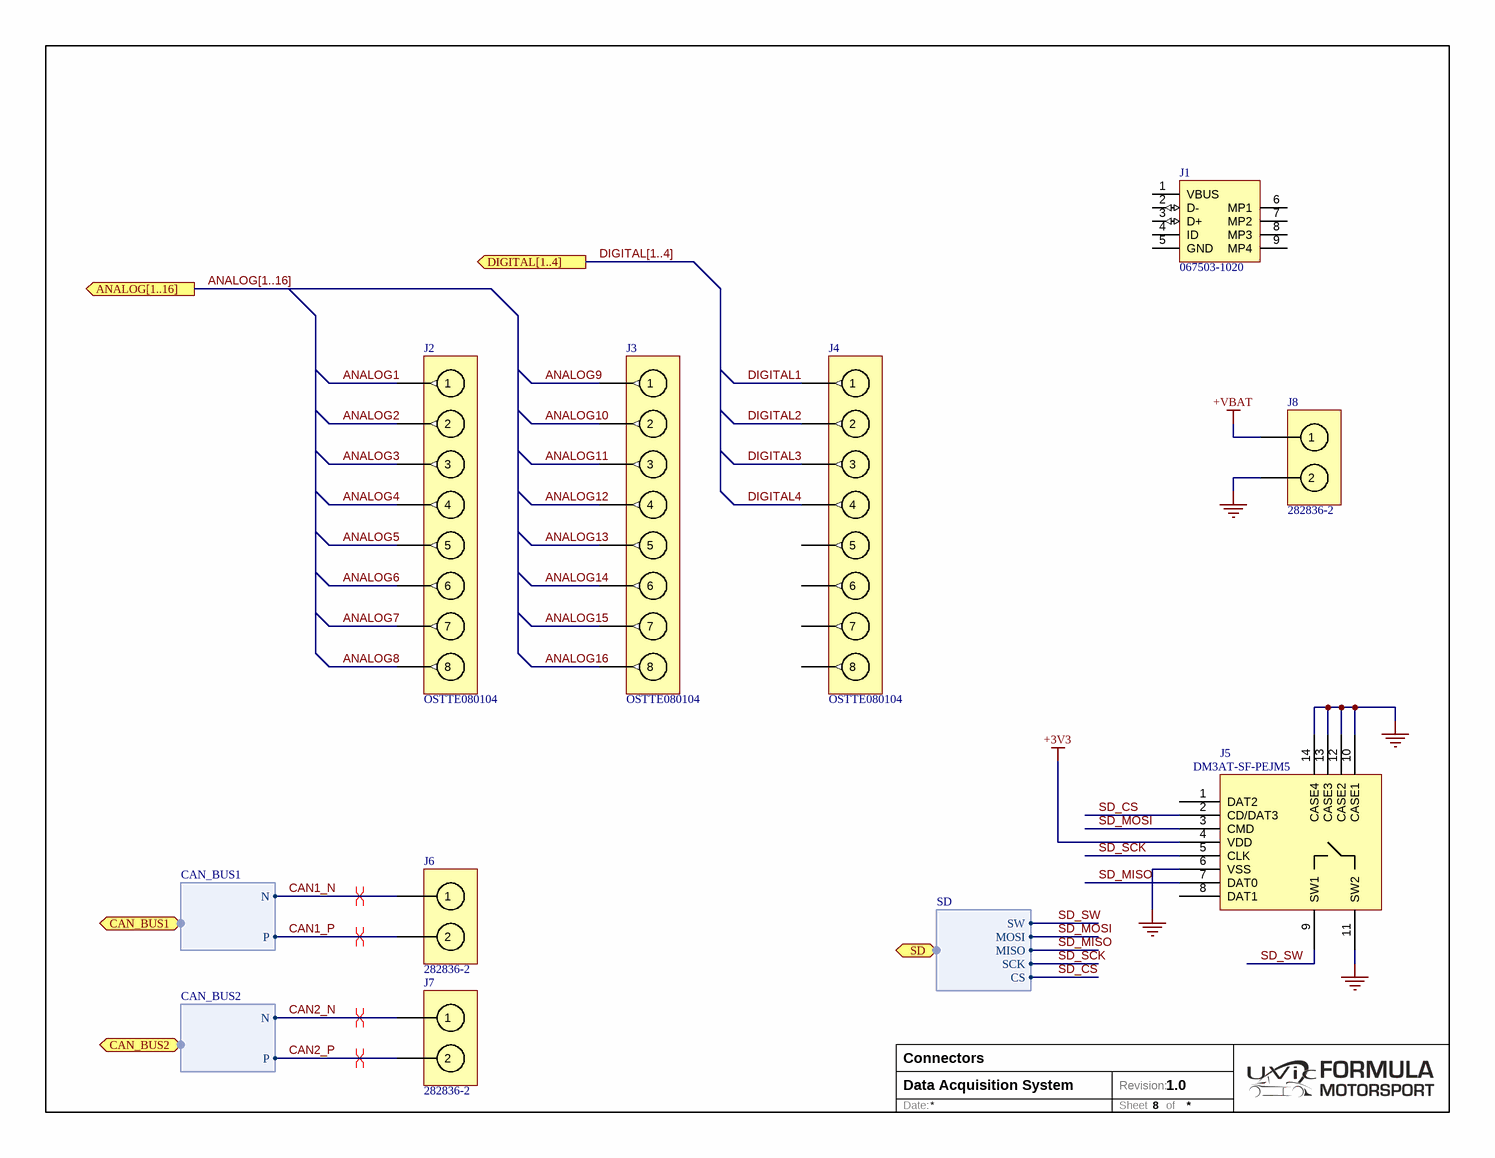
[diagram p5: Connectors.SchDoc]

### Parts
(Parts that share a designator on the sheet are numbered #1, #2 ... from top to bottom, then left to right.)
J1  067503-1020  [MOLX-67503-1020_V]
J2  OSTTE080104  [OSTTE0801x4]
J3  OSTTE080104  [OSTTE0801x4]
J4  OSTTE080104  [OSTTE0801x4]
J5  DM3AT-SF-PEJM5  [uSD_DM3AT]
J6  282836-2  [282836-2]
J7  282836-2  [282836-2]
J8#2  282836-2  [282836-2]

### Ports
ANALOG[1..16] (out), CAN_BUS1 (harness CAN_BUS1), CAN_BUS2 (harness CAN_BUS2), DIGITAL[1..4] (out), SD (harness SD)

### Harnesses
CAN_BUS1: N, P
CAN_BUS2: N, P
SD: MOSI, MISO, SCK, CS, SW

### Nets
+3V3: J5.4(VDD)
+VBAT: J8#2.1
GND: J5.6(VSS) J5.10(CASE1) J5.11(SW2) J5.12(CASE2) J5.13(CASE3) J5.14(CASE4) J8#2.2
ANALOG1: J2.1
ANALOG2: J2.2
ANALOG3: J2.3
ANALOG4: J2.4
ANALOG5: J2.5
ANALOG6: J2.6
ANALOG7: J2.7
ANALOG8: J2.8
ANALOG9: J3.1
ANALOG10: J3.2
ANALOG11: J3.3
ANALOG12: J3.4
ANALOG13: J3.5
ANALOG14: J3.6
ANALOG15: J3.7
ANALOG16: J3.8
CAN1_N: J6.1 ; port CAN_BUS1.N
CAN1_P: J6.2 ; port CAN_BUS1.P
CAN2_N: J7.1 ; port CAN_BUS2.N
CAN2_P: J7.2 ; port CAN_BUS2.P
DIGITAL1: J4.1
DIGITAL2: J4.2
DIGITAL3: J4.3
DIGITAL4: J4.4
SD_CS: J5.2(CD/DAT3) ; port SD.CS  [project net SD.CS]
SD_MISO: J5.7(DAT0) ; port SD.MISO  [project net SD.MISO]
SD_MOSI: J5.3(CMD) ; port SD.MOSI  [project net SD.MOSI]
SD_SCK: J5.5(CLK) ; port SD.SCK  [project net SD.SCK]
SD_SW: J5.9(SW1) ; port SD.SW  [project net SD.SW]

Not connected (* = marked no-connect by the designer): J1 1(VBUS) 2(D-) 3(D+) 4(ID) 5(GND) 6(MP1) 7(MP2) 8(MP3) 9(MP4); J4 5 6 7 8; J5 1(DAT2) 8(DAT1)

### Buses and harness runs
bus ANALOG[1..16] = port ANALOG[1..16]
bus DIGITAL[1..4] = port DIGITAL[1..4]

### Layout directives
differential pair: CAN1_N, CAN1_P, CAN2_N, CAN2_P

### Notes on the sheet
- Date:
- Revision:
- Sheet
- of

### Library data of the parts
J1 = 067503-1020: USB Mini-B; Supplier 1: Digi-Key; Supplier Part Number 1: WM5461CT-ND
J2-J4 = OSTTE0801x4: Terminal Block 8-pos; Supplier 1: Digi-Key; Supplier Part Number 1: ED2746-ND
J5 = DM3AT-SF-PEJM5: CONN MICRO SD R/A PUSH-PUSH SMD; Manufacturer: Hirose Electric Co Ltd; .Checked PCB: MM; Connector Type: Connector and Ejector; Card Type: Secure Digital - microSD TransFlash; Number of Positions: 10 (8 + 2); Insertion, Removal Method: Push In, Push Out; .Checked SCH: MM; Category: Connectors, Interconnects; Supplier Part Number: HR1964CT-ND; Family: Memory - PC Card Connectors; Manufacturer Part Number: DM3AT-SF-PEJM5; Price 1k [$]: 1.85200; Supplier: Digikey; Supplier 1: Digi-Key; Supplier Part Number 1: HR1964CT-ND; RoHS: RoHS Compliant; Stock 1: 7044; Pricing 1: 1=2.96, 10=2.457, 50=2.0476, 100=1.82, 250=1.5106, 500=1.365 (USD); Ejector Side: -; Mounting Type: Surface Mount, Right Angle; Features: Switch; Height Above Board: 0.066" (1.68mm); Mounting Feature: Normal, Standard - Top; Packaging: Cut Tape (CT); Contact Finish: Gold; Contact Finish Thickness: -; ComponentLink1URL: http://www.hirose.co.jp/cataloge_hp/e60900232.pdf; ComponentLink1Description: http://www.hirose.co.jp/cataloge_hp/e60900232.pdf
J6 J7 J8#2 = 282836-2: Terminal Block 2-pos Side Entry 5mm; Supplier 1: Digi-Key; Supplier Part Number 1: A98076-ND

## Sheet Analog.SchDoc: Analog Input Filter and Protection
size Letter; Revision: 1.0; SheetNumber: 5; PageSetup: Record=PageOptions|CenterHorizontal=True|CenterVertical=True|PrintScale=1.00|XCorrection=1.00|YCorrection=1.00|PrintKind=1|BorderSize=5000000|LeftOffset=0|BottomOffset=0|Orientation=2|PaperLength=1000|PaperWidth=1000|Scale=100|PaperSource=7|PrintQuality=-3|MediaType=1|DitherType=10|PrintScaleMode=1|PaperKind=Letter|PaperIndex=1; ProjectTitle: Data Acquisition System
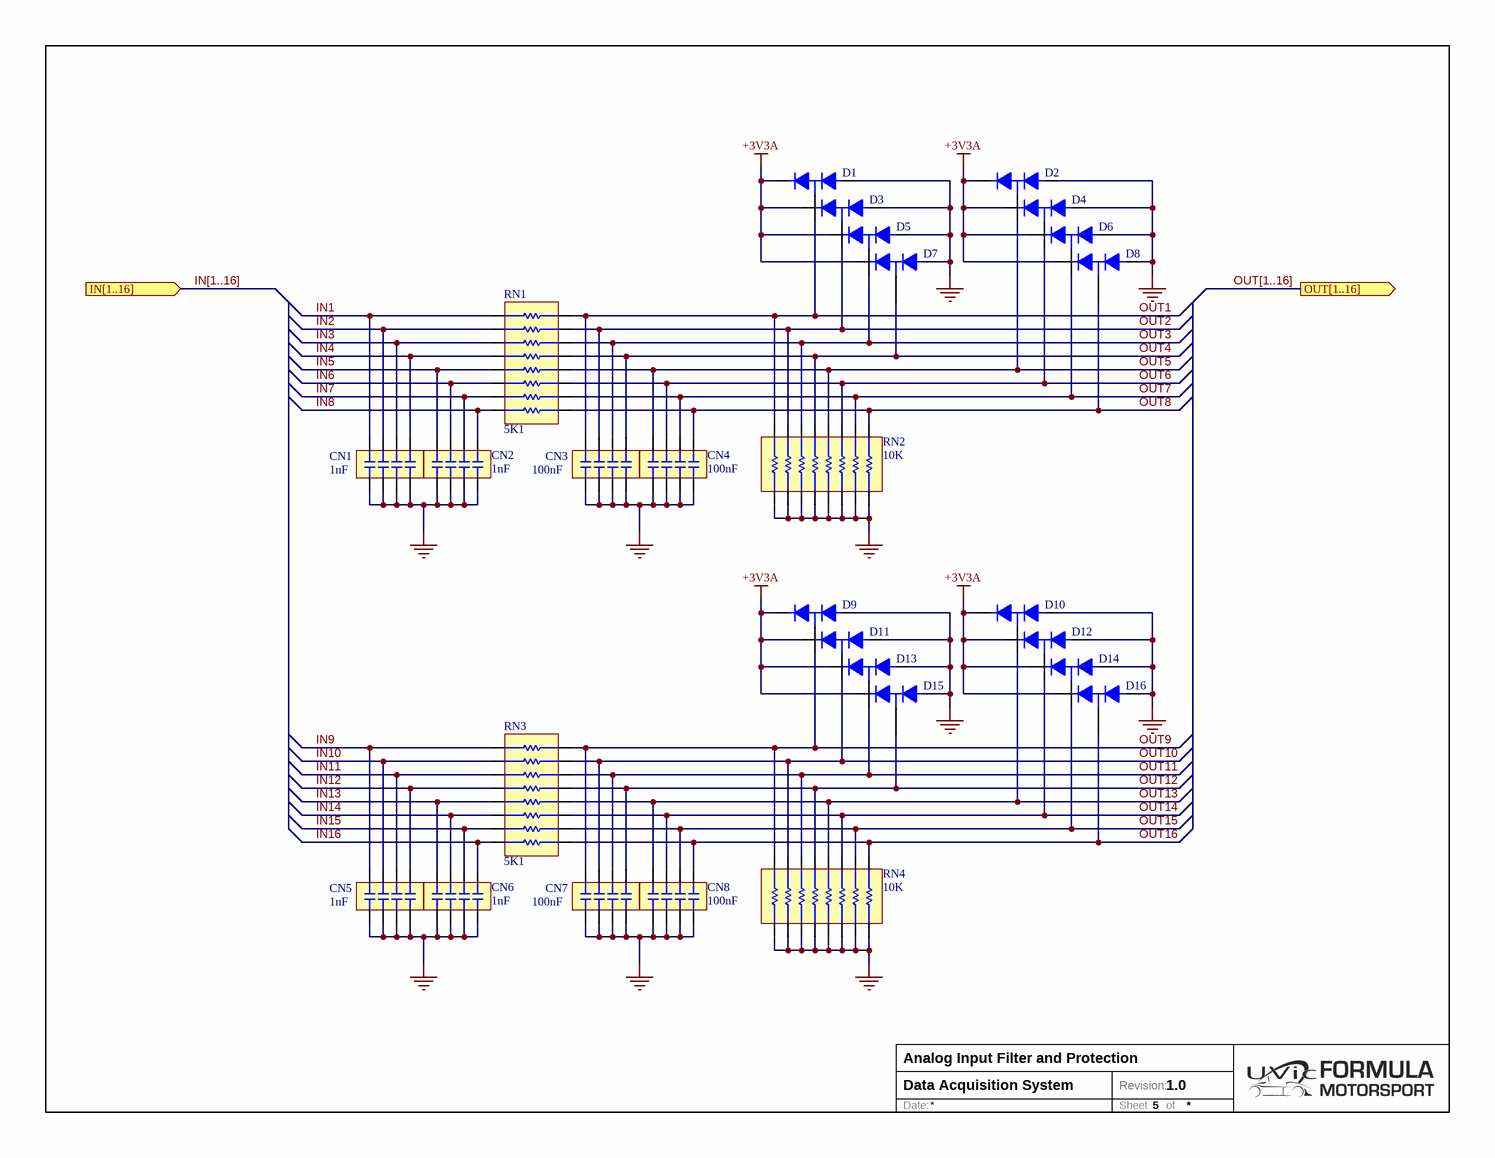
[diagram p6: Analog.SchDoc]

### Parts
CN1  value 1nF  [CAF-80P319X159-8N]  (hidden comment: CKCA43X7R1H102M100AA)
CN2  value 1nF  [CAF-80P319X159-8N]  (hidden comment: CKCA43X7R1H102M100AA)
CN3  value 100nF  [CAF-80P319X159-8N]  (hidden comment: CKCA43X7R1C104M100AA)
CN4  value 100nF  [CAF-80P319X159-8N]  (hidden comment: CKCA43X7R1C104M100AA)
CN5  value 1nF  [CAF-80P319X159-8N]  (hidden comment: CKCA43X7R1H102M100AA)
CN6  value 1nF  [CAF-80P319X159-8N]  (hidden comment: CKCA43X7R1H102M100AA)
CN7  value 100nF  [CAF-80P319X159-8N]  (hidden comment: CKCA43X7R1C104M100AA)
CN8  value 100nF  [CAF-80P319X159-8N]  (hidden comment: CKCA43X7R1C104M100AA)
D1  BAS70-04LT1G  [ONSC-SOT-23-3-318-08_V]  (value not drawn)
D2  BAS70-04LT1G  [ONSC-SOT-23-3-318-08_V]  (value not drawn)
D3  BAS70-04LT1G  [ONSC-SOT-23-3-318-08_V]  (value not drawn)
D4  BAS70-04LT1G  [ONSC-SOT-23-3-318-08_V]  (value not drawn)
D5  BAS70-04LT1G  [ONSC-SOT-23-3-318-08_V]  (value not drawn)
D6  BAS70-04LT1G  [ONSC-SOT-23-3-318-08_V]  (value not drawn)
D7  BAS70-04LT1G  [ONSC-SOT-23-3-318-08_V]  (value not drawn)
D8  BAS70-04LT1G  [ONSC-SOT-23-3-318-08_V]  (value not drawn)
D9  BAS70-04LT1G  [ONSC-SOT-23-3-318-08_V]  (value not drawn)
D10  BAS70-04LT1G  [ONSC-SOT-23-3-318-08_V]  (value not drawn)
D11  BAS70-04LT1G  [ONSC-SOT-23-3-318-08_V]  (value not drawn)
D12  BAS70-04LT1G  [ONSC-SOT-23-3-318-08_V]  (value not drawn)
D13  BAS70-04LT1G  [ONSC-SOT-23-3-318-08_V]  (value not drawn)
D14  BAS70-04LT1G  [ONSC-SOT-23-3-318-08_V]  (value not drawn)
D15  BAS70-04LT1G  [ONSC-SOT-23-3-318-08_V]  (value not drawn)
D16  BAS70-04LT1G  [ONSC-SOT-23-3-318-08_V]  (value not drawn)
RN1  value 5K1  [CAF-80P160X100-8N]  (hidden comment: MNR18ERAPJ512)
RN2  value 10K  [CAF-80P160X100-8N]  (hidden comment: MNR18ERAPJ103)
RN3  value 5K1  [CAF-80P160X100-8N]  (hidden comment: MNR18ERAPJ512)
RN4  value 10K  [CAF-80P160X100-8N]  (hidden comment: MNR18ERAPJ103)

### Ports
IN[1..16] (in), OUT[1..16] (out)

### Nets
+3V3A: D1.2(K) D2.2(K) D3.2(K) D4.2(K) D5.2(K) D6.2(K) D7.2(K) D8.2(K) D9.2(K) D10.2(K) D11.2(K) D12.2(K) D13.2(K) D14.2(K) D15.2(K) D16.2(K)
GND: CN1.1 CN1.2 CN1.3 CN1.4 CN2.1 CN2.2 CN2.3 CN2.4 CN3.1 CN3.2 CN3.3 CN3.4 CN4.1 CN4.2 CN4.3 CN4.4 CN5.1 CN5.2 CN5.3 CN5.4 CN6.1 CN6.2 CN6.3 CN6.4 CN7.1 CN7.2 CN7.3 CN7.4 CN8.1 CN8.2 CN8.3 CN8.4 D1.1(A) D2.1(A) D3.1(A) D4.1(A) D5.1(A) D6.1(A) D7.1(A) D8.1(A) D9.1(A) D10.1(A) D11.1(A) D12.1(A) D13.1(A) D14.1(A) D15.1(A) D16.1(A) RN2.9 RN2.10 RN2.11 RN2.12 RN2.13 RN2.14 RN2.15 RN2.16 RN4.9 RN4.10 RN4.11 RN4.12 RN4.13 RN4.14 RN4.15 RN4.16
IN1: CN1.8 RN1.9  [project net ANALOG1]
IN2: CN1.7 RN1.10  [project net ANALOG2]
IN3: CN1.6 RN1.11  [project net ANALOG3]
IN4: CN1.5 RN1.12  [project net ANALOG4]
IN5: CN2.8 RN1.13  [project net ANALOG5]
IN6: CN2.7 RN1.14  [project net ANALOG6]
IN7: CN2.6 RN1.15  [project net ANALOG7]
IN8: CN2.5 RN1.16  [project net ANALOG8]
IN9: CN5.8 RN3.9  [project net ANALOG9]
IN10: CN5.7 RN3.10  [project net ANALOG10]
IN11: CN5.6 RN3.11  [project net ANALOG11]
IN12: CN5.5 RN3.12  [project net ANALOG12]
IN13: CN6.8 RN3.13  [project net ANALOG13]
IN14: CN6.7 RN3.14  [project net ANALOG14]
IN15: CN6.6 RN3.15  [project net ANALOG15]
IN16: CN6.5 RN3.16  [project net ANALOG16]
OUT1: CN3.8 D1.3(K/A) RN1.8 RN2.8  [project net AIN1]
OUT2: CN3.7 D3.3(K/A) RN1.7 RN2.7  [project net AIN2]
OUT3: CN3.6 D5.3(K/A) RN1.6 RN2.6  [project net AIN3]
OUT4: CN3.5 D7.3(K/A) RN1.5 RN2.5  [project net AIN4]
OUT5: CN4.8 D2.3(K/A) RN1.4 RN2.4  [project net AIN5]
OUT6: CN4.7 D4.3(K/A) RN1.3 RN2.3  [project net AIN6]
OUT7: CN4.6 D6.3(K/A) RN1.2 RN2.2  [project net AIN7]
OUT8: CN4.5 D8.3(K/A) RN1.1 RN2.1  [project net AIN8]
OUT9: CN7.8 D9.3(K/A) RN3.8 RN4.8  [project net AIN9]
OUT10: CN7.7 D11.3(K/A) RN3.7 RN4.7  [project net AIN10]
OUT11: CN7.6 D13.3(K/A) RN3.6 RN4.6  [project net AIN11]
OUT12: CN7.5 D15.3(K/A) RN3.5 RN4.5  [project net AIN12]
OUT13: CN8.8 D10.3(K/A) RN3.4 RN4.4  [project net AIN13]
OUT14: CN8.7 D12.3(K/A) RN3.3 RN4.3  [project net AIN14]
OUT15: CN8.6 D14.3(K/A) RN3.2 RN4.2  [project net AIN15]
OUT16: CN8.5 D16.3(K/A) RN3.1 RN4.1  [project net AIN16]

### Buses and harness runs
bus IN[1..16] = port IN[1..16]
bus OUT[1..16] = port OUT[1..16]

### Notes on the sheet
- Date:
- Revision:
- Sheet
- of

### Library data of the parts
CN1 CN2 CN5 CN6 = CKCA43X7R1H102M100AA: Capacitor Array - 1nF - 4x - Isolated; Voltage: 16V; Supplier 1: Digi-Key; Supplier Part Number 1: 445-1851-1-ND
CN3 CN4 CN7 CN8 = CKCA43X7R1C104M100AA: Capacitor Array - 100nF - 4x - Isolated; Voltage: 16V; Supplier 1: Digi-Key; Supplier Part Number 1: 445-1857-1-ND
D1-D16 = BAS70-04LT1G: Schottky Diode Array; Supplier 1: Digi-Key; Supplier Part Number 1: BAS70-04LT1GOSCT-ND
RN1 RN3 = MNR18ERAPJ512: Resistor Array - 5K1 - x8 - Independent; Tolerance: 5%; Supplier 1: Digi-Key; Supplier Part Number 1: RHM1559CT-ND
RN2 RN4 = MNR18ERAPJ103: Resistor Array - 10K - x8 - Independent; Tolerance: 5%; Supplier 1: Digi-Key; Supplier Part Number 1: RHM1621CT-ND

## Sheet Digital.SchDoc: Digital Input Protection and LEDs
size Letter; Revision: 1.0; SheetNumber: 6; PageSetup: Record=PageOptions|CenterHorizontal=True|CenterVertical=True|PrintScale=0.98|XCorrection=1.00|YCorrection=1.00|PrintKind=1|BorderSize=5000000|LeftOffset=0|BottomOffset=0|Orientation=2|PaperLength=1000|PaperWidth=1000|Scale=100|PaperSource=7|PrintQuality=-3|MediaType=1|DitherType=10|PrintScaleMode=1|PaperKind=Letter|PaperIndex=1; ProjectTitle: Data Acquisition System

### Notes on the sheet
- Date:
- Revision:
- Sheet
- of

## Sheet Mechanical.SchDoc: Mechanical
size Letter; Revision: 1.0; SheetNumber: 9; PageSetup: Record=PageOptions|CenterHorizontal=True|CenterVertical=True|PrintScale=1.00|XCorrection=1.00|YCorrection=1.00|PrintKind=1|BorderSize=5000000|LeftOffset=0|BottomOffset=0|Orientation=2|PaperLength=1000|PaperWidth=1000|Scale=100|PaperSource=7|PrintQuality=-3|MediaType=1|DitherType=10|PrintScaleMode=1|PaperKind=Letter|PaperIndex=1; ProjectTitle: Data Acquisition System
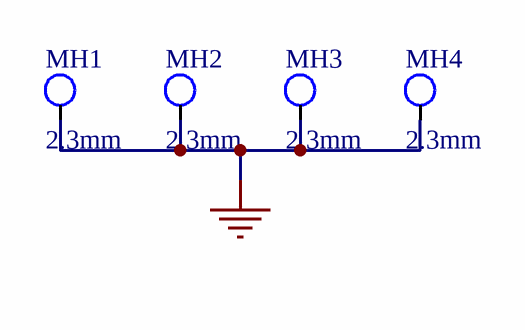
[diagram p7: Mechanical.SchDoc]

### Parts
MH1  2.3mm  [MH-2.3mm]
MH2  2.3mm  [MH-2.3mm]
MH3  2.3mm  [MH-2.3mm]
MH4  2.3mm  [MH-2.3mm]

### Nets
GND: MH1.1 MH2.1 MH3.1 MH4.1

### Notes on the sheet
- Date:
- Revision:
- Sheet
- of

### Library data of the parts
MH1-MH4 = MH-2.3mm: Mounting Hole 2.3mm

## Nets that join several sheets
+3V3: Microcontroller (9 pins), Power (24 pins), Peripherals (R16.2), Connectors (J5.4)
+3V3A: Power (5 pins), Analog (16 pins)
+VBAT: Power (C7.2 D21.2 VR1.2), Connectors (J8#2.1)
GND: Microcontroller (15 pins), Power (41 pins), Connectors (7 pins), Analog (64 pins), Mechanical (MH1.1 MH2.1 MH3.1 MH4.1)
AIN1: Microcontroller (U1.23), Analog (CN3.8 D1.3 RN1.8 RN2.8)
AIN2: Microcontroller (U1.24), Analog (CN3.7 D3.3 RN1.7 RN2.7)
AIN3: Microcontroller (U1.25), Analog (CN3.6 D5.3 RN1.6 RN2.6)
AIN4: Microcontroller (U1.26), Analog (CN3.5 D7.3 RN1.5 RN2.5)
AIN5: Microcontroller (U1.29), Analog (CN4.8 D2.3 RN1.4 RN2.4)
AIN6: Microcontroller (U1.30), Analog (CN4.7 D4.3 RN1.3 RN2.3)
AIN7: Microcontroller (U1.31), Analog (CN4.6 D6.3 RN1.2 RN2.2)
AIN8: Microcontroller (U1.32), Analog (CN4.5 D8.3 RN1.1 RN2.1)
AIN9: Microcontroller (U1.35), Analog (CN7.8 D9.3 RN3.8 RN4.8)
AIN10: Microcontroller (U1.36), Analog (CN7.7 D11.3 RN3.7 RN4.7)
AIN11: Microcontroller (U1.15), Analog (CN7.6 D13.3 RN3.6 RN4.6)
AIN12: Microcontroller (U1.16), Analog (CN7.5 D15.3 RN3.5 RN4.5)
AIN13: Microcontroller (U1.17), Analog (CN8.8 D10.3 RN3.4 RN4.4)
AIN14: Microcontroller (U1.18), Analog (CN8.7 D12.3 RN3.3 RN4.3)
AIN15: Microcontroller (U1.33), Analog (CN8.6 D14.3 RN3.2 RN4.2)
AIN16: Microcontroller (U1.34), Analog (CN8.5 D16.3 RN3.1 RN4.1)
ANALOG1: Connectors (J2.1), Analog (CN1.8 RN1.9)
ANALOG2: Connectors (J2.2), Analog (CN1.7 RN1.10)
ANALOG3: Connectors (J2.3), Analog (CN1.6 RN1.11)
ANALOG4: Connectors (J2.4), Analog (CN1.5 RN1.12)
ANALOG5: Connectors (J2.5), Analog (CN2.8 RN1.13)
ANALOG6: Connectors (J2.6), Analog (CN2.7 RN1.14)
ANALOG7: Connectors (J2.7), Analog (CN2.6 RN1.15)
ANALOG8: Connectors (J2.8), Analog (CN2.5 RN1.16)
ANALOG9: Connectors (J3.1), Analog (CN5.8 RN3.9)
ANALOG10: Connectors (J3.2), Analog (CN5.7 RN3.10)
ANALOG11: Connectors (J3.3), Analog (CN5.6 RN3.11)
ANALOG12: Connectors (J3.4), Analog (CN5.5 RN3.12)
ANALOG13: Connectors (J3.5), Analog (CN6.8 RN3.13)
ANALOG14: Connectors (J3.6), Analog (CN6.7 RN3.14)
ANALOG15: Connectors (J3.7), Analog (CN6.6 RN3.15)
ANALOG16: Connectors (J3.8), Analog (CN6.5 RN3.16)
CAN1.RX: Microcontroller (U1.95), Peripherals (U2.4)
CAN1.TX: Microcontroller (U1.96), Peripherals (U2.1)
CAN1_N: Peripherals (R11.2 U2.12), Connectors (J6.1)
CAN1_P: Peripherals (R12.2 U2.13), Connectors (J6.2)
CAN2.RX: Microcontroller (U1.91), Peripherals (U2.7)
CAN2.TX: Microcontroller (U1.92), Peripherals (U2.6)
CAN2_N: Peripherals (R13.2 U2.9), Connectors (J7.1)
CAN2_P: Peripherals (R14.2 U2.10), Connectors (J7.2)
~{NAND_CE}: Microcontroller (U1.88), Peripherals (U3.9)
~{NAND_OE}: Microcontroller (U1.85), Peripherals (U3.8)
~{NAND_WAIT}: Microcontroller (R10.2 U1.87), Peripherals (U3.7)
~{NAND_WE}: Microcontroller (U1.86), Peripherals (U3.18)
NAND.ALE: Microcontroller (U1.59), Peripherals (U3.17)
NAND.CLE: Microcontroller (U1.58), Peripherals (U3.16)
NAND_D0: Microcontroller (U1.61), Peripherals (U3.26)
NAND_D1: Microcontroller (U1.62), Peripherals (U3.28)
NAND_D2: Microcontroller (U1.81), Peripherals (U3.30)
NAND_D3: Microcontroller (U1.82), Peripherals (U3.32)
NAND_D4: Microcontroller (U1.38), Peripherals (U3.40)
NAND_D5: Microcontroller (U1.39), Peripherals (U3.42)
NAND_D6: Microcontroller (U1.40), Peripherals (U3.44)
NAND_D7: Microcontroller (U1.41), Peripherals (U3.46)
NAND_D8: Microcontroller (U1.42), Peripherals (U3.27)
NAND_D9: Microcontroller (U1.43), Peripherals (U3.29)
NAND_D10: Microcontroller (U1.44), Peripherals (U3.31)
NAND_D11: Microcontroller (U1.45), Peripherals (U3.33)
NAND_D12: Microcontroller (U1.46), Peripherals (U3.41)
NAND_D13: Microcontroller (U1.55), Peripherals (U3.43)
NAND_D14: Microcontroller (U1.56), Peripherals (U3.45)
NAND_D15: Microcontroller (U1.57), Peripherals (U3.47)
SD.CS: Microcontroller (U1.51), Connectors (J5.2)
SD.MISO: Microcontroller (U1.53), Connectors (J5.7)
SD.MOSI: Microcontroller (U1.54), Connectors (J5.3)
SD.SCK: Microcontroller (U1.52), Connectors (J5.5)
SD.SW: Microcontroller (R9.2 U1.93), Connectors (J5.9)